# EAGLE design Week2ATTINY4-5-9-10 (EAGLE 8.3.1)
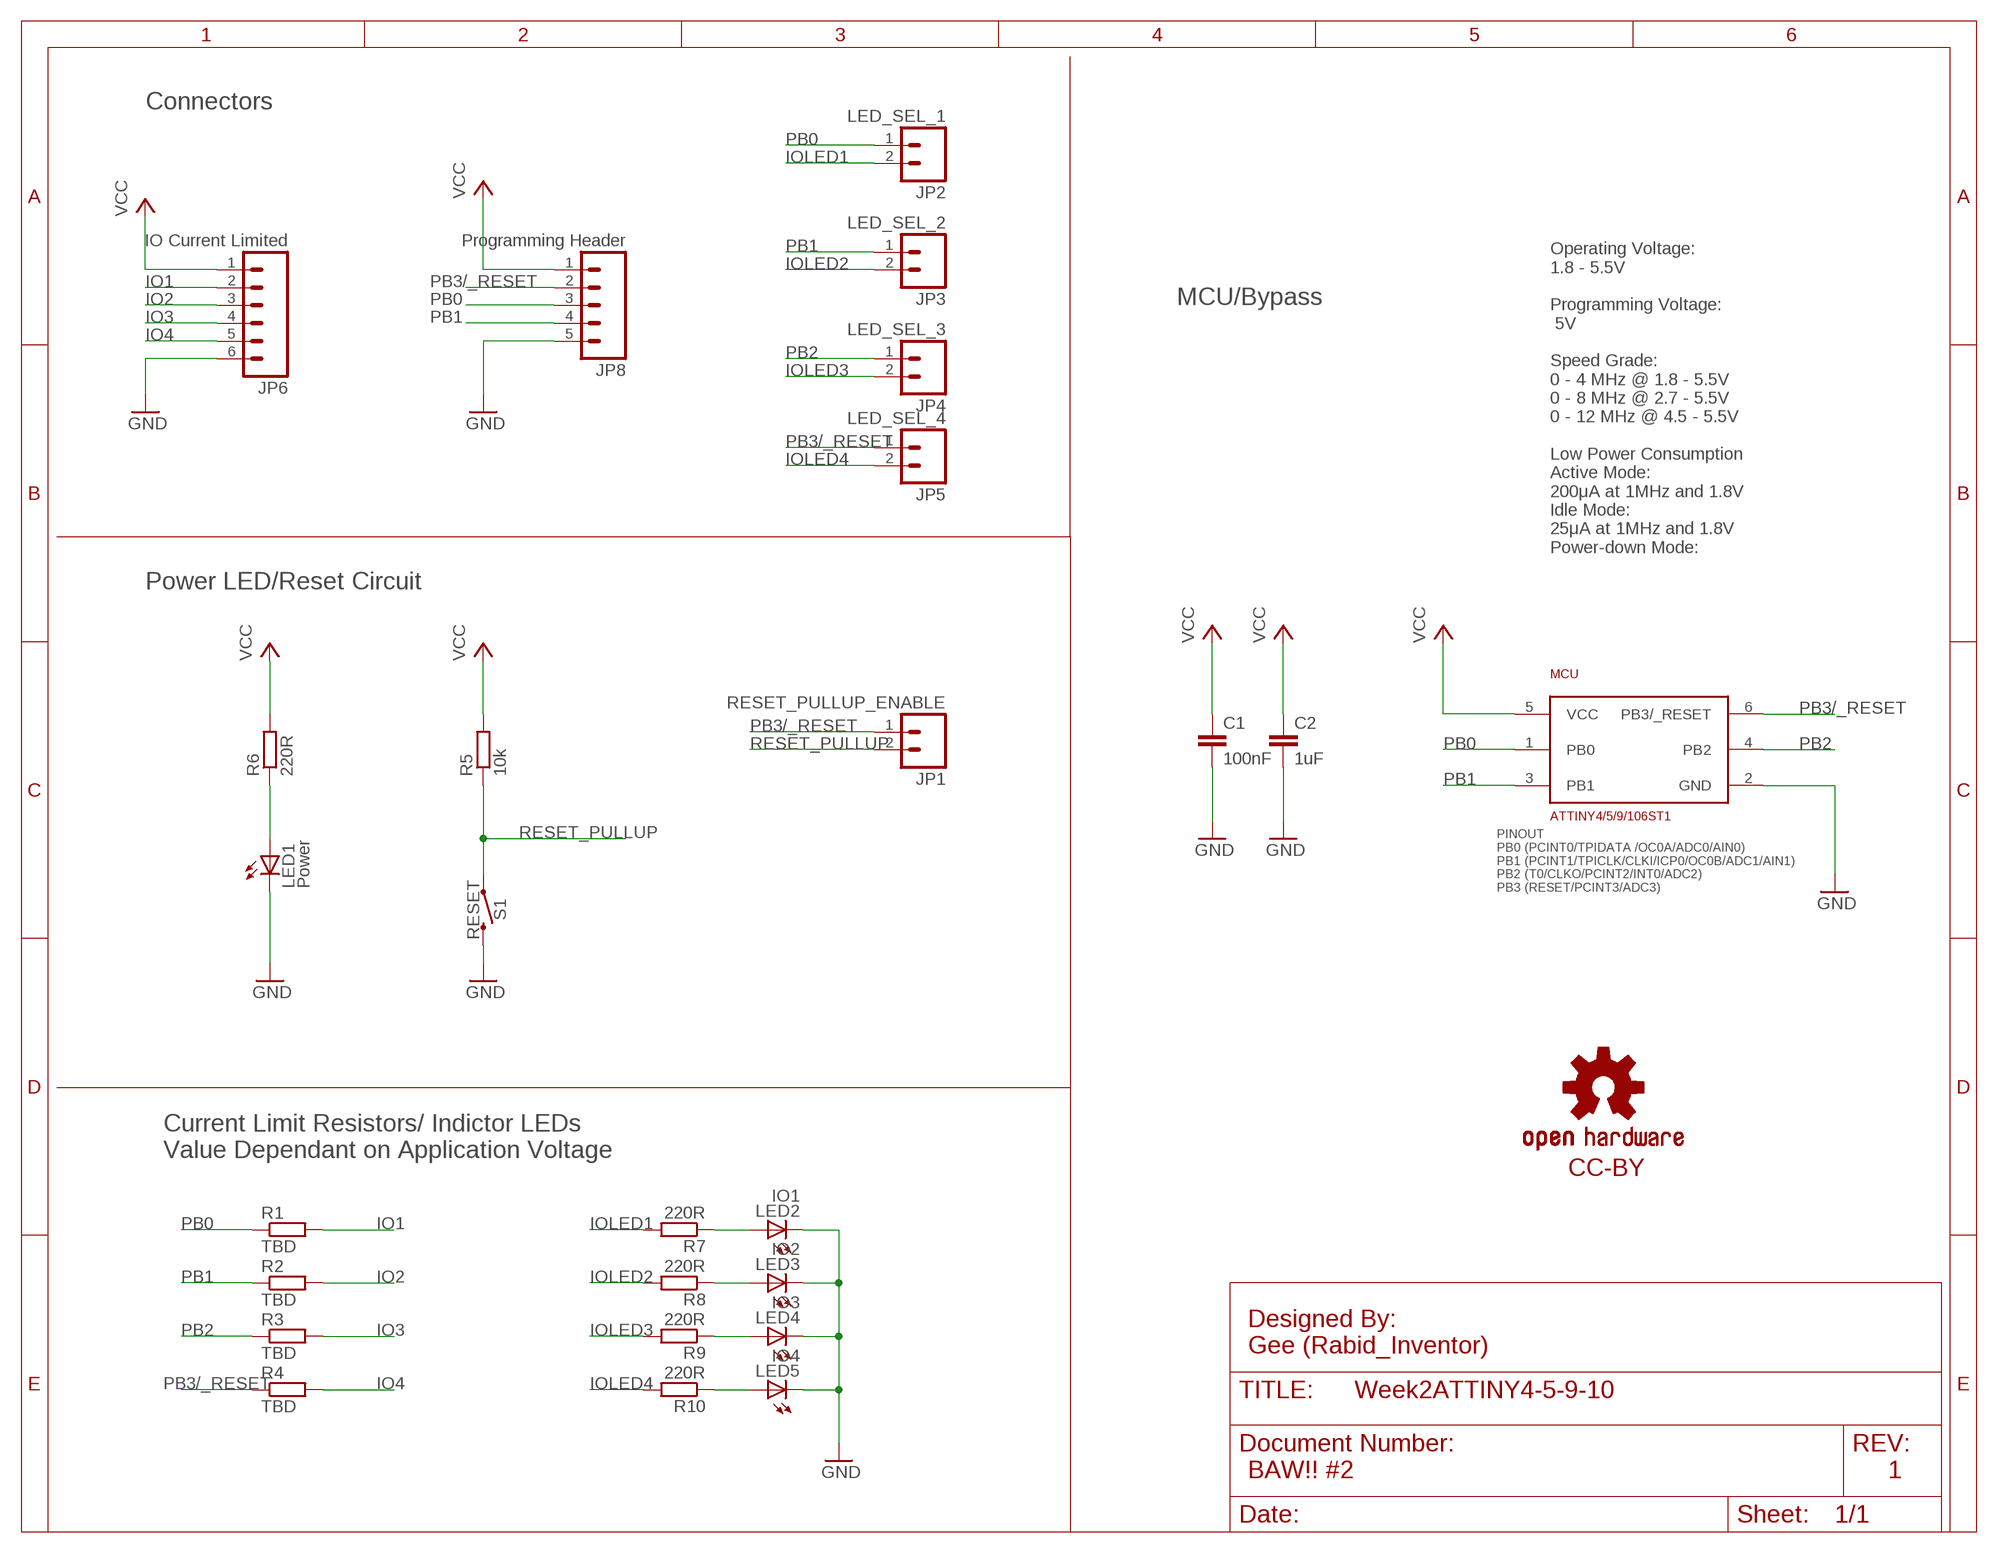
[diagram p0: schematic, sheet 1]

## Parts
C1  100nF  C-EUC0603K  [C0603K]
C2  1uF  C-EUC0603K  [C0603K]
JP1  RESET_PULLUP_ENABLE  M021X02_NO_SILK  [1X02_NO_SILK]
JP2  LED_SEL_1  M021X02_NO_SILK  [1X02_NO_SILK]
JP3  LED_SEL_2  M021X02_NO_SILK  [1X02_NO_SILK]
JP4  LED_SEL_3  M021X02_NO_SILK  [1X02_NO_SILK]
JP5  LED_SEL_4  M021X02_NO_SILK  [1X02_NO_SILK]
JP6  IO Current Limited  M06NO_SILK  [1X06_NO_SILK]
JP8  Programming Header  M05NO_SILK  [1X05_NO_SILK]
LED1  Power  LEDCHIPLED_0805  [CHIPLED_0805]
LED2  IO1  LEDCHIPLED_0805  [CHIPLED_0805]
LED3  IO2  LEDCHIPLED_0805  [CHIPLED_0805]
LED4  IO3  LEDCHIPLED_0805  [CHIPLED_0805]
LED5  IO4  LEDCHIPLED_0805  [CHIPLED_0805]
LOGO1  OSHW-LOGOMINI  [OSHW-LOGO-MINI]
MCU  ATTINY4/5/9/106ST1  [SOT23-6AVR]
R1  TBD  R-EU_R0603  [R0603]
R2  TBD  R-EU_R0603  [R0603]
R3  TBD  R-EU_R0603  [R0603]
R4  TBD  R-EU_R0603  [R0603]
R5  10k  R-EU_R0603  [R0603]
R6  220R  R-EU_R0603  [R0603]
R7  220R  R-EU_R0603  [R0603]
R8  220R  R-EU_R0603  [R0603]
R9  220R  R-EU_R0603  [R0603]
R10  220R  R-EU_R0603  [R0603]
S1  RESET  MOMENTARY-SWITCH-SPST-PTH-6.0MM  [TACTILE_SWITCH_PTH_6.0MM]

## Nets
GND: C1.2 C2.2 JP6.6 JP8.5 LED1.C LED2.C LED3.C LED4.C LED5.C MCU.2(GND) S1.3
IO1: JP6.2 R1.2
IO2: JP6.3 R2.2
IO3: JP6.4 R3.2
IO4: JP6.5 R4.2
IOLED1: JP2.2 R7.2
IOLED2: JP3.2 R8.2
IOLED3: JP4.2 R9.2
IOLED4: JP5.2 R10.2
N$1: LED1.A R6.1
N$2: LED2.A R7.1
N$3: LED3.A R8.1
N$4: LED4.A R9.1
N$5: LED5.A R10.1
PB0: JP2.1 JP8.3 MCU.1(PB0) R1.1
PB1: JP3.1 JP8.4 MCU.3(PB1) R2.1
PB2: JP4.1 MCU.4(PB2) R3.1
PB3/_RESET: JP1.1 JP5.1 JP8.2 MCU.6(PB3/_RESET) R4.1
RESET_PULLUP: JP1.2 R5.1 S1.1
VCC: C1.1 C2.1 JP6.1 JP8.1 MCU.5(VCC) R5.2 R6.2

## Notes on the sheet
- Connectors
- MCU/Bypass
- Operating Voltage: 
  1.8 - 5.5V
  
  Programming Voltage: 
   5V 
  
  Speed Grade: 
  0 - 4 MHz @ 1.8 - 5.5V 
  0 - 8 MHz @ 2.7 - 5.5V
  0 - 12 MHz @ 4.5 - 5.5V 
  
  Low Power Consumption 
  Active Mode: 
  200μA at 1MHz and 1.8V 
  Idle Mode: 
  25μA at 1MHz and 1.8V 
  Power-down Mode:
- Power LED/Reset Circuit
- Current Limit Resistors/ Indictor LEDs
  Value Dependant on Application Voltage
- CC-BY
- Designed By: 
  Gee (Rabid_Inventor)
- BAW!! #2 | 1

## Library data of the parts
C1 C2 = rcl:C-EU: CAPACITOR, European symbol
JP1-JP5 = SparkFun-Connectors:M02: Standard 2-pin 0.1" header. Use with - straight break away headers ( PRT-00116) - right angle break away headers (PRT-00553) - swiss pins (PRT-00743) - machine pins (PRT-00117) - female headers (PRT-00115) Molex polarized connector foot print use with: PRT-08233 with associated crimp pins and housings. 2.54_SCREWTERM for use with PRT-10571. 3.5mm Screw Terminal footprints for PRT-08084 5mm Screw Terminal footprints for use with PRT-08433
JP6 = SparkFun-Connectors:M06: Header 6 Standard 6-pin 0.1" header. Use with straight break away headers (SKU : PRT-00116), right angle break away headers (PRT-00553), swiss pins (PRT-00743), machine pins (PRT-00117), and female headers (PRT-00115). Molex polarized connector foot print use with SKU : PRT-08094 with associated crimp pins and housings. NOTES ON THE VARIANTS LOCK and LOCK_LONGPADS... This footprint was designed to help hold the alignment of a through-hole component (i.e. 6-pin header) while soldering it into place. You may notice that each hole has been shifted either up or down by 0.005 of an inch from it's more standard position (which is a perfectly straight line). This slight alteration caused the pins (the squares in the middle) to touch the edges of the holes. Because they are alternating, it causes a "brace" to hold the component in place. 0.005 has proven to be the perfect amount of "off-center" position when using our standard breakaway headers. Although looks a little odd when you look at the bare footprint, once you have a header in there, the alteration is very hard to notice. Also,if you push a header all the way into place, it is covered up entirely on the bottom side. This idea of altering the position of holes to aid alignment will be further integrated into the Sparkfun Library for other footprints. It can help hold any component with 3 or more connection pins.
JP8 = SparkFun-Connectors:M05: Header 5 Standard 5-pin 0.1" header. Use with straight break away headers (SKU : PRT-00116), right angle break away headers (PRT-00553), swiss pins (PRT-00743), machine pins (PRT-00117), and female headers (PRT-00115). Molex polarized connector foot print use with SKU : PRT-08230 with associated crimp pins and housings.
LED1-LED5 = led:LED: LED OSRAM: - CHIPLED LG R971, LG N971, LY N971, LG Q971, LY Q971, LO R971, LY R971 LH N974, LH R974 LS Q976, LO Q976, LY Q976 LO Q996 - Hyper CHIPLED LW Q18S LB Q993, LB Q99A, LB R99A - SideLED LS A670, LO A670, LY A670, LG A670, LP A670 LB A673, LV A673, LT A673, LW A673 LH A674 LY A675 LS A676, LA A676, LO A676, LY A676, LW A676 LS A679, LY A679, LG A679 - Hyper Micro SIDELED® LS Y876, LA Y876, LO Y876, LY Y876 LT Y87S - SmartLED LW L88C, LW L88S LB L89C, LB L89S, LG L890 LS L89K, LO L89K, LY L89K LS L896, LA L896, LO L896, LY L896 - TOPLED LS T670, LO T670, LY T670, LG T670, LP T670 LSG T670, LSP T670, LSY T670, LOP T670, LYG T670 LG T671, LOG T671, LSG T671 LB T673, LV T673, LT T673, LW T673 LH T674 LS T676, LA T676, LO T676, LY T676, LB T676, LH T676, LSB T676, LW T676 LB T67C, LV T67C, LT T67C, LS T67K, LO T67K, LY T67K, LW E67C LS E67B, LA E67B, LO E67B, LY E67B, LB E67C, LV E67C, LT E67C LW T67C LS T679, LY T679, LG T679 LS T770, LO T770, LY T770, LG T770, LP T770 LB T773, LV T773, LT T773, LW T773 LH T774 LS E675, LA E675, LY E675, LS T675 LS T776, LA T776, LO T776, LY T776, LB T776 LHGB T686 LT T68C, LB T68C - Hyper Mini TOPLED® LB M676 - Mini TOPLED Santana® LG M470 LS M47K, LO M47K, LY M47K Source: http://www.osram.convergy.de LUXEON: - LUMILED® LXK2-PW12-R00, LXK2-PW12-S00, LXK2-PW14-U00, LXK2-PW14-V00 LXK2-PM12-R00, LXK2-PM12-S00, LXK2-PM14-U00 LXK2-PE12-Q00, LXK2-PE12-R00, LXK2-PE12-S00, LXK2-PE14-T00, LXK2-PE14-U00 LXK2-PB12-K00, LXK2-PB12-L00, LXK2-PB12-M00, LXK2-PB14-N00, LXK2-PB14-P00, LXK2-PB14-Q00 LXK2-PR12-L00, LXK2-PR12-M00, LXK2-PR14-Q00, LXK2-PR14-R00 LXK2-PD12-Q00, LXK2-PD12-R00, LXK2-PD12-S00 LXK2-PH12-R00, LXK2-PH12-S00 LXK2-PL12-P00, LXK2-PL12-Q00, LXK2-PL12-R00 Source: www.luxeon.com KINGBRIGHT: KA-3528ASYC Source: www.kingbright.com
LOGO1 = SparkFun-Aesthetics:OSHW-LOGO: Open-Source Hardware (OSHW) Logo This logo indicates the piece of hardware it is found on incorporates a OSHW license and/or adheres to the definition of open source hardware found here: http://freedomdefined.org/OSHW
MCU = eaglepartslib:ATTINY4/5/9/10
R1-R10 = rcl:R-EU_: RESISTOR, European symbol
S1 = SparkFun-Switches:MOMENTARY-SWITCH-SPST: Momentary Switch (Pushbutton) - SPST Normally-open (NO) SPST momentary switches (buttons, pushbuttons). Variants PTH-12MM - 12mm square, through-hole Momentary Pushbutton Switch - 12mm Square <https://www.sparkfun.com/products/9190> (COM-09190) PTH-6.0MM, PTH-6.0MM-KIT - 6.0mm square, through-hole Mini Pushbutton Switch <https://www.sparkfun.com/products/97> (COM-00097) KIT package intended for soldering kit's - only one side of pads' copper is exposed. PTH-RIGHT-ANGLE-KIT - Right-angle, through-hole Right Angle Tactile Button <https://www.sparkfun.com/products/10791> - Used on SparkFun BigTime Watch Kit <https://www.sparkfun.com/products/11734> SMD-12MM - 12mm square, surface-mount Tactile Button - SMD (12mm) <https://www.sparkfun.com/products/12993> (COM-12993) Used on SparkFun PicoBoard <https://www.sparkfun.com/products/11888> SMD-4.5MM - 4.5mm Square Trackball Switch Used on SparkFun Blackberry Trackballer Breakout <https://www.sparkfun.com/products/13169> SMD-4.6MMX2.8MM - 4.60mm x 2.80mm, surface mount Used on SparkFun SAMD21 Mini Breakout <https://www.sparkfun.com/products/13664> SMD-5.2MM, SMD-5.2-REDUNDANT - 5.2mm square, surface-mount Mini Pushbutton Switch - SMD <https://www.sparkfun.com/products/8720> (COM-08720) Used on Arduino Pro Mini <https://www.sparkfun.com/products/11114> REDUNDANT package connects both switch circuits together SMD-6.0X3.5MM - 6.0 x 3.5mm, surface mount Momentary Reset Switch SMD <https://www.sparkfun.com/products/8229> (COM-08229) SMD-6.2MM-TALL - 6.2mm square, surface mount Tactile Button - SMD (6mm) <https://www.sparkfun.com/products/12992> Used on SparkFun Digital Sandbox <https://www.sparkfun.com/products/12651> SMD-RIGHT-ANGLE - Right-angle, surface mount Used on SparkFun Block for Intel® Edison - Arduino <https://www.sparkfun.com/products/13036>; PROD_ID: SWCH-08441; SF_SKU: COM-00097

## Board
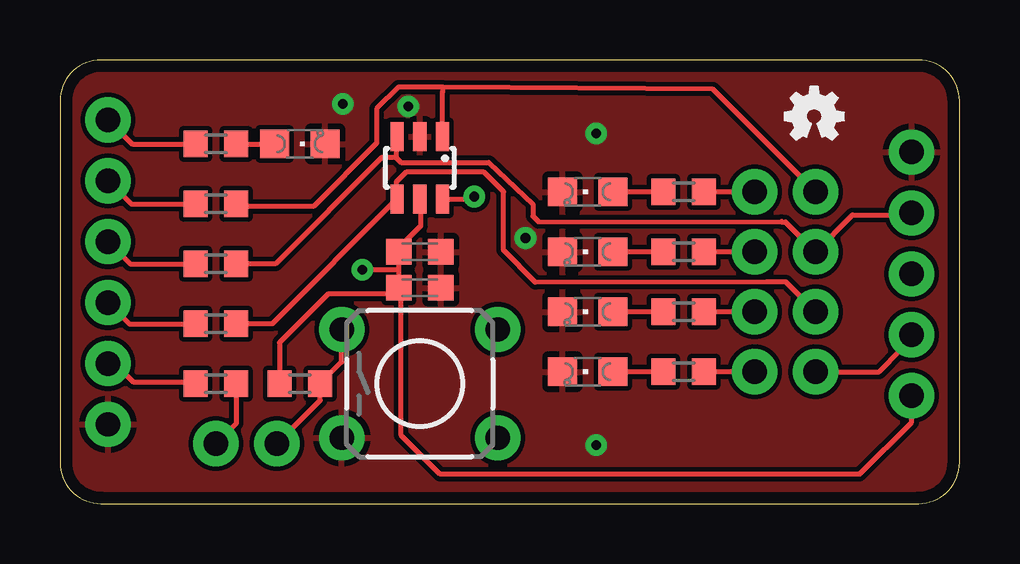
[diagram p1: board, top side]
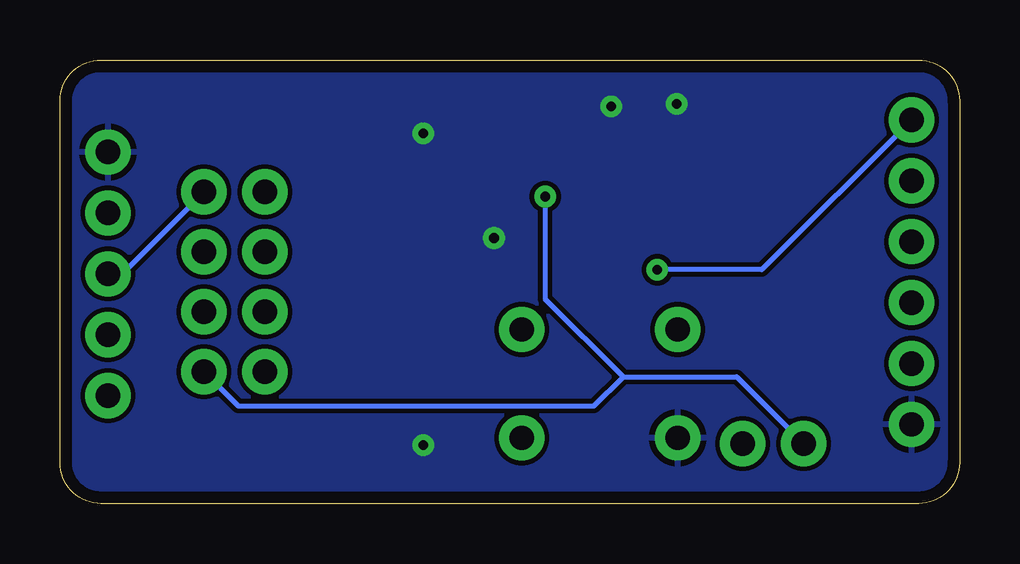
[diagram p2: board, bottom side, seen from below]

Size 37.5 x 18.5 mm. Coordinates in mm from the lower left corner, seen from the top.
Outline: 0,16.79 0,1.71 arc90 1.71,0 35.79,0 arc90 37.5,1.71 37.5,16.79 arc90 35.79,18.5 1.71,18.5 arc90 0,16.79
Copper layers (1*16): Top 0.035mm / dielectric 1.5mm / Bottom 0.035mm
Design rules "pimoroni": minimum track width 0.2mm, minimum drill 0.3mm, track to track 0.2mm, track to pad 0.2mm, pad to pad 0.2mm, via to via 0.2mm, smd to smd 0.15mm, copper to edge 0.5mm, drill to drill 0.15mm, minimum pad ring 0.3mm, minimum via ring 0.25mm, stop-mask expansion 0.05mm, vias tented up to drill 0.6mm, thermal gap 0.25mm

### Footprints (pad centres in the part's own frame; a part is rotated, then mirrored left to right if it is on the bottom)
C0603K = smd 1.05 x 1.08: 1 -0.875,0; 2 0.875,0
1X02_NO_SILK = drill 1.016 pad 1.88: 1 0,0; 2 2.54,0
1X06_NO_SILK = drill 1.016 pad 1.88: 1 0,0; 2 2.54,0; 3 5.08,0; 4 7.62,0; 5 10.16,0; 6 12.7,0
1X05_NO_SILK = drill 1.016 pad 1.88: 1 0,0; 2 2.54,0; 3 5.08,0; 4 7.62,0; 5 10.16,0
CHIPLED_0805 = smd 1.2 x 1.2: A 0,-1.05; C 0,1.05
SOT23-6AVR = smd 0.55 x 1.2: 1 0.95,1.3; 2 0,1.3; 3 -0.95,1.3; 4 -0.95,-1.3; 5 0,-1.3; 6 0.95,-1.3
R0603 = smd 1 x 1.1: 1 -0.85,0; 2 0.85,0
TACTILE_SWITCH_PTH_6.0MM = drill 1.016 pad 1.88: 1 -3.251,2.261; 2 3.251,2.261; 3 -3.251,-2.261; 4 3.251,-2.261

### Placement (x,y rotation side)
C1  15,10.5 0 top
C2  15,9 0 top
JP1  6.5,2.5 0 top
JP2  31.5,13 180 top
JP3  31.5,10.5 180 top
JP4  31.5,8 180 top
JP5  31.5,5.5 180 top
JP6  2,16 270 top
JP8  35.5,4.5 90 top
LED1  10,15 270 top
LED2  22,13 90 top
LED3  22,10.5 90 top
LED4  22,8 90 top
LED5  22,5.5 90 top
LOGO1  31.44,16.16 0 top
MCU  15,14 0 top
R1  6.5,12.5 180 top
R2  6.5,10 180 top
R3  6.5,7.5 180 top
R4  6.5,5 180 top
R5  10,5 180 top
R6  6.5,15 180 top
R7  26,13 0 top
R8  26,10.5 0 top
R9  26,8 0 top
R10  26,5.5 0 top
S1  15,5 0 top

### Tracks (layer width: path | path; a pad name or v marks a point on that pad's centre or on a via)
GND  (via drill 0.4)
  other vias: 14.53,16.56 11.79,16.66 22.35,2.44 19.41,11.07 22.35,15.44
  pour Top: -1,-1 -1,21 39,21 39,-1
  pour Bottom: -2,-2 -2,21 41,21 41,-2
IO1
  Top 0.203: JP6.2 2.96,12.5 R1.2
IO2
  Top 0.203: JP6.3 2.92,10 R2.2
IO3
  Top 0.203: JP6.4 2.88,7.5 R3.2
IO4
  Top 0.203: JP6.5 2.29,5.84 3.05,5.08 5.57,5.08 R4.2
IOLED1
  Top 0.203: JP2.2 R7.2
IOLED2
  Top 0.203: JP3.2 R8.2
IOLED3
  Top 0.203: JP4.2 R9.2
IOLED4
  Top 0.203: JP5.2 R10.2
N$1
  Top 0.203: R6.1 LED1.A
N$2
  Top 0.203: R7.1 LED2.A
N$3
  Top 0.203: R8.1 LED3.A
N$4
  Top 0.203: R9.1 LED4.A
N$5
  Top 0.203: R10.1 LED5.A
PB0
  Top 0.203: MCU.1 15.95,17.17 15.95,17.37 | 15.95,17.37 14.12,17.37 13.21,16.46 13.21,15.04 10.57,12.39 7.46,12.39 R1.1 | JP2.1 27.23,17.27 15.95,17.37
  Bottom 0.203: JP2.1 35,9.5 35.08,9.58 JP8.3
PB1
  Top 0.203: MCU.3 14.02,15.27 14.02,14.43 | 14.02,14.43 13.41,14.43 8.98,10 R2.1 | 14.02,14.43 14.22,14.22 17.88,14.22 19.71,12.5 19.71,11.99 19.94,11.75 30.07,11.74 30.08,11.76 30.09,11.75 30.25,11.75 JP3.1 33.04,12.04 35.42,12.04 JP8.4
PB2
  Top 0.203: 14.02,12.67 MCU.4 | 14.02,12.67 8.85,7.5 R3.1 | JP4.1 30.25,9.25 29.48,9.25 29.45,9.24 19.81,9.22 18.49,10.57 18.49,13.01 17.68,13.82 14.43,13.82 14.02,13.41 14.02,12.67
PB3/_RESET  (via drill 0.4)
  Top 0.203: R4.1 7.35,3.35 JP1.1 | MCU.6 17.17,12.7 v17.27,12.8 | JP8.2 35.05,6.59 35.05,6.4 34.15,5.5 JP5.1
  Bottom 0.203: v17.27,12.8 17.27,8.53 14.02,5.28 | 14.02,5.28 9.28,5.28 JP1.1 | JP5.1 30.06,4.06 15.24,4.06 14.02,5.28
RESET_PULLUP
  Top 0.203: JP1.2 10.85,4.31 R5.1 11.75,5.9 S1.1
VCC  (via drill 0.4)
  Top 0.203: JP6.1 3,15 R6.2 | MCU.5 15.04,12.66 15.04,11.58 14.12,10.67 C1.1 14.12,9.75 | C2.1 14.12,9.75 | C2.1 13.86,8.74 11.18,8.74 9.15,6.71 R5.2 | v12.6,9.75 14.12,9.75 | C2.1 14.22,8.9 14.22,2.85 15.85,1.22 33.33,1.22 35.5,3.39 JP8.1
  Bottom 0.203: JP6.1 8.25,9.75 v12.6,9.75